# EAGLE schematic Everything (EAGLE 7.2.0)
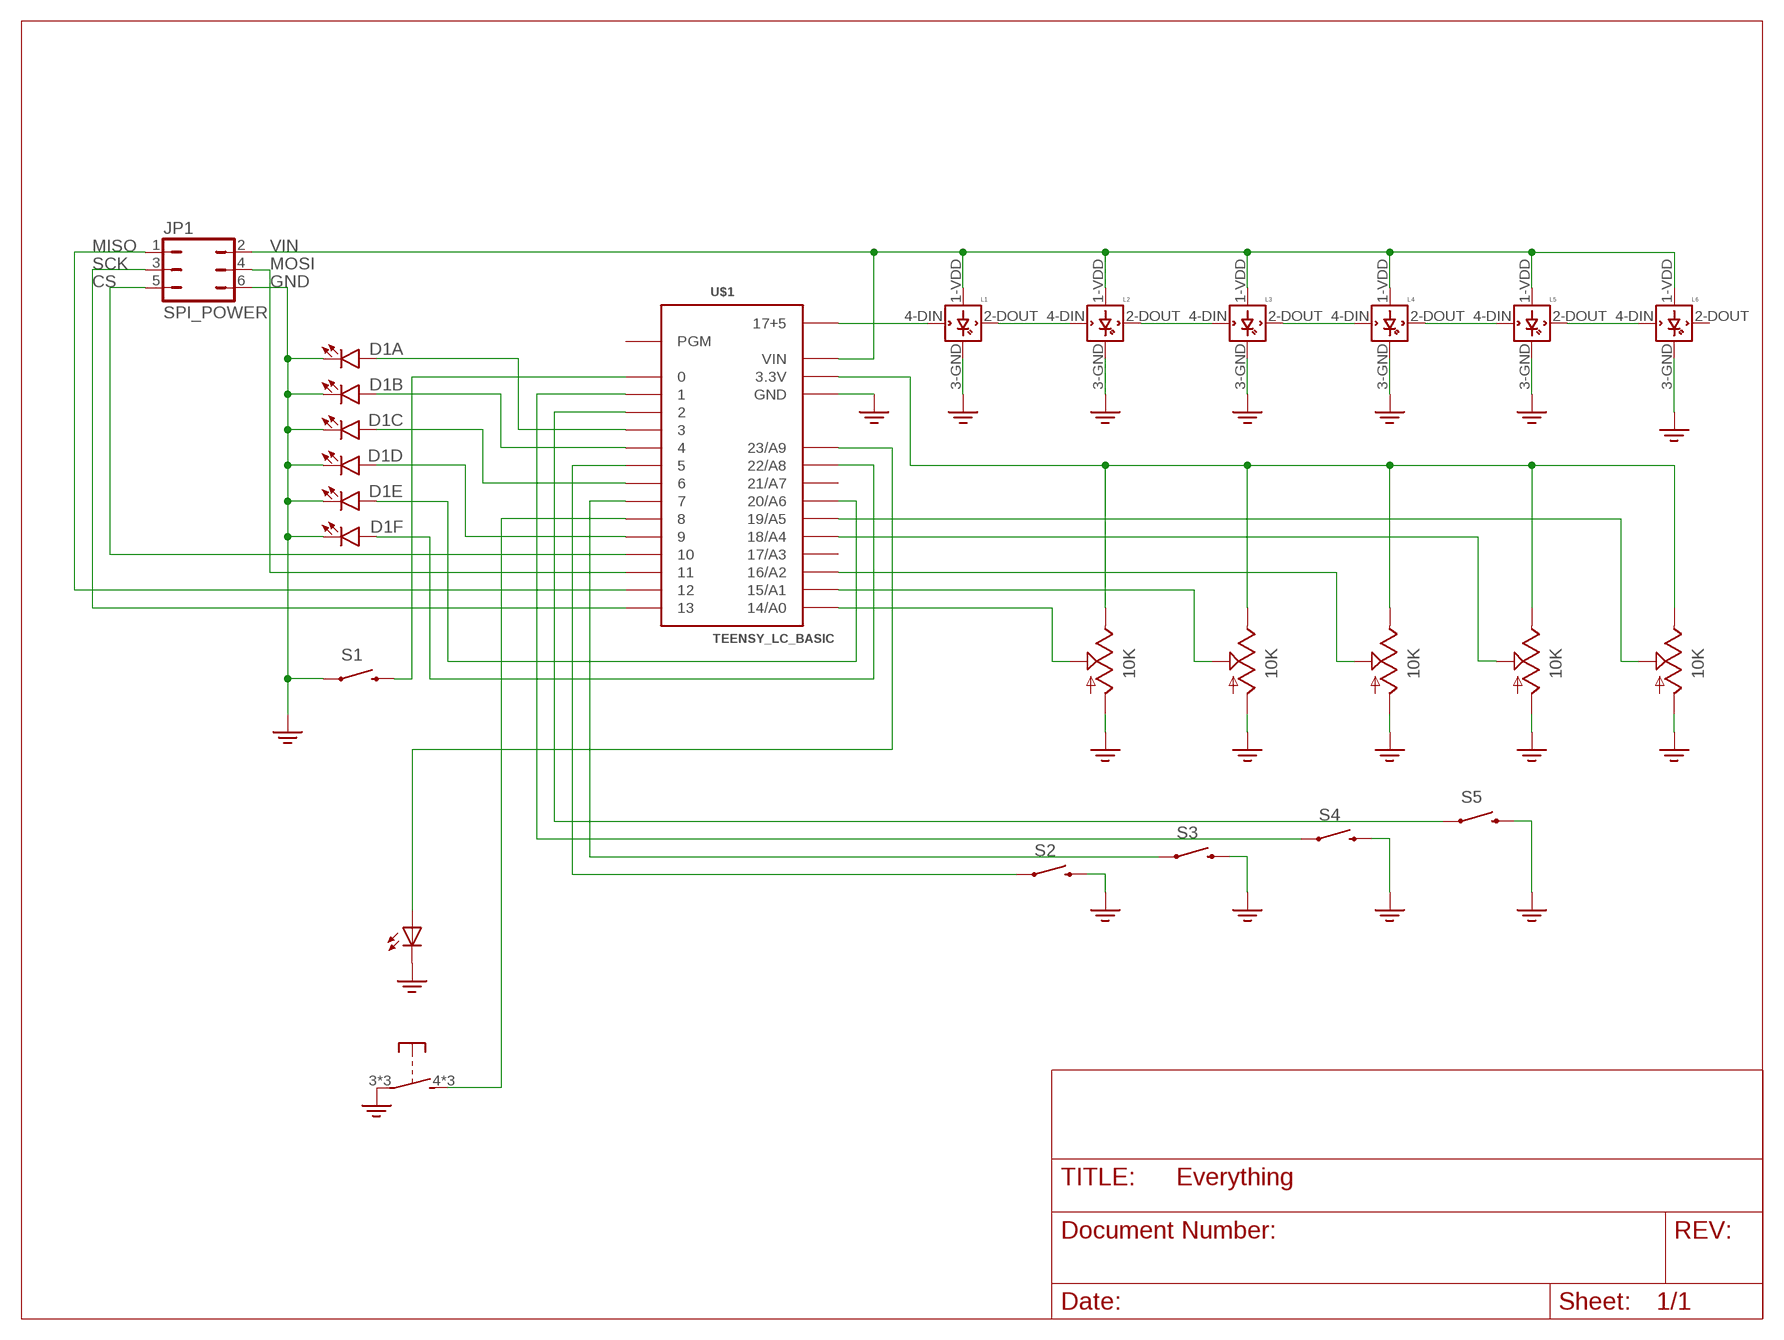
[diagram p0: schematic, sheet 1]

## Parts
D1  LED_BARGRAPH_6  [LED_BARGRAPH_6]
JP1  SPI_POWER  JP3Q  [JP3Q]
L1  WS2812B  [WS2812B]
L2  WS2812B  [WS2812B]
L3  WS2812B  [WS2812B]
L4  WS2812B  [WS2812B]
L5  WS2812B  [WS2812B]
L6  WS2812B  [WS2812B]
S1  SWITCH-MOMENTARY-212MM  [TACTILE-PTH-12MM]
S2  SWITCH-MOMENTARY-2SMD  [TACTILE-SWITCH-SMD]
S3  SWITCH-MOMENTARY-2SMD  [TACTILE-SWITCH-SMD]
S4  SWITCH-MOMENTARY-2SMD  [TACTILE-SWITCH-SMD]
S5  SWITCH-MOMENTARY-2SMD  [TACTILE-SWITCH-SMD]
U$1  TEENSY_LC_BASIC  [TEENSY_LC_BASIC]
U$2  10K  ALPHA1400F10K  [14MMPOT]
U$3  10K  ALPHA1400F10K  [14MMPOT]
U$4  10K  ALPHA1400F10K  [14MMPOT]
U$5  10K  ALPHA1400F10K  [14MMPOT]
U$6  10K  ALPHA1400F10K  [14MMPOT]
U$7  TL1220MEZZ  [MEZZ]

## Nets
3.3V: U$1.3.3V U$1.3.3V1(3.3V) U$2.P$4(E) U$3.P$4(E) U$4.P$4(E) U$5.P$4(E) U$6.P$4(E)
GND: D1.7(F:C) D1.8(E:C) D1.9(D:C) D1.10(C:C) D1.11(B:C) D1.12(A:C) JP1.6 L1.3-GND(GND) L2.3-GND(GND) L3.3-GND(GND) L4.3-GND(GND) L5.3-GND(GND) L6.3-GND(GND) S1.1 S2.3 S3.3 S4.3 S5.3 U$1.GND U$1.GND1(GND) U$1.GND2(GND) U$2.P$5(A) U$3.P$5(A) U$4.P$5(A) U$5.P$5(A) U$6.P$5(A) U$7.2(C) U$7.3(P) U$7.P$1(P) U$7.P$2(P) U$7.P$6(C) ; supply symbol labelled GND2
N$1: L1.4-DIN(DIN) U$1.17+5
N$2: L1.2-DOUT(DOUT) L2.4-DIN(DIN)
N$3: L2.2-DOUT(DOUT) L3.4-DIN(DIN)
N$4: L3.2-DOUT(DOUT) L4.4-DIN(DIN)
N$5: L4.2-DOUT(DOUT) L5.4-DIN(DIN)
N$6: U$1.23/A9 U$7.1(A) U$7.P$5(A)
N$7: U$1.14/A0 U$2.P$3(S)
N$8: U$1.15/A1 U$3.P$3(S)
N$9: U$1.16/A2 U$4.P$3(S)
N$10: U$1.18/A4 U$5.P$3(S)
N$11: U$1.8 U$7.4(S) U$7.P$3(S) U$7.P$4(S)
N$12: S2.1 U$1.5
N$13: S3.1 U$1.7
N$14: S4.1 U$1.1
N$15: D1.1(A:A) U$1.3
N$16: D1.2(B:A) U$1.4
N$17: D1.3(C:A) U$1.6
N$18: D1.4(D:A) U$1.9
N$19: D1.5(E:A) U$1.20/A6
N$20: D1.6(F:A) U$1.22/A8
N$21: JP1.1 U$1.12
N$22: S1.3 U$1.0
N$23: JP1.3 U$1.13
N$24: JP1.5 U$1.10
N$25: S5.1 U$1.2
N$26: L5.2-DOUT(DOUT) L6.4-DIN(DIN)
N$27: U$1.19/A5 U$6.P$3(S)
N$28: JP1.4 U$1.11
VIN: JP1.2 L1.1-VDD(VDD) L2.1-VDD(VDD) L3.1-VDD(VDD) L4.1-VDD(VDD) L5.1-VDD(VDD) L6.1-VDD(VDD) U$1.VIN
Unconnected: L6.2-DOUT(DOUT) U$1.17/A3 U$1.21/A7 U$1.PGM

## Notes on the sheet
- MISO | VIN
- SCK | MOSI
- CS | GND

## Library data of the parts
D1 = SynthLib:LED_BARGRAPH_6: 10-Segment LED Bar Graph SFE part numbers: COM-09935 (red, Vf = 2.1V, Ifmax = 20mA) COM-09936 (yellow, Vf = 2.1V, Ifmax = 20mA) COM-09937 (blue, Vf = 3.4V, Ifmax = 20mA) COM-09938 (green, Vf = 3.4V, Ifmax = 20mA)
JP1 = jumper:JP3Q: JUMPER
L1-L6 = SynthLib:WS2812B
S1 = SynthLib:SWITCH-MOMENTARY-2: Various NO switches- pushbuttons, reed, etc; PROD_ID: SWCH-09185
S2-S5 = SynthLib:SWITCH-MOMENTARY-2: Various NO switches- pushbuttons, reed, etc; PROD_ID: SWCH-08247
U$1 = SynthLib:TEENSY_LC_BASIC: Basic Teensy LC with none of the 'inner' pins enabled. See '+4', 'AllAnalogPins", and 'AllPins' packages for additional pin holes, as needed.
U$2-U$6 = SynthLib:ALPHA1400F: Alpha 1400F series clear shaft potentiometer
U$7 = SynthLib:TL1220MEZZ